# Altium schematic sheet 5_OUTPUTS.SchDoc
size 420 x 297 mm; SheetNumber: 5; SheetTotal: 5
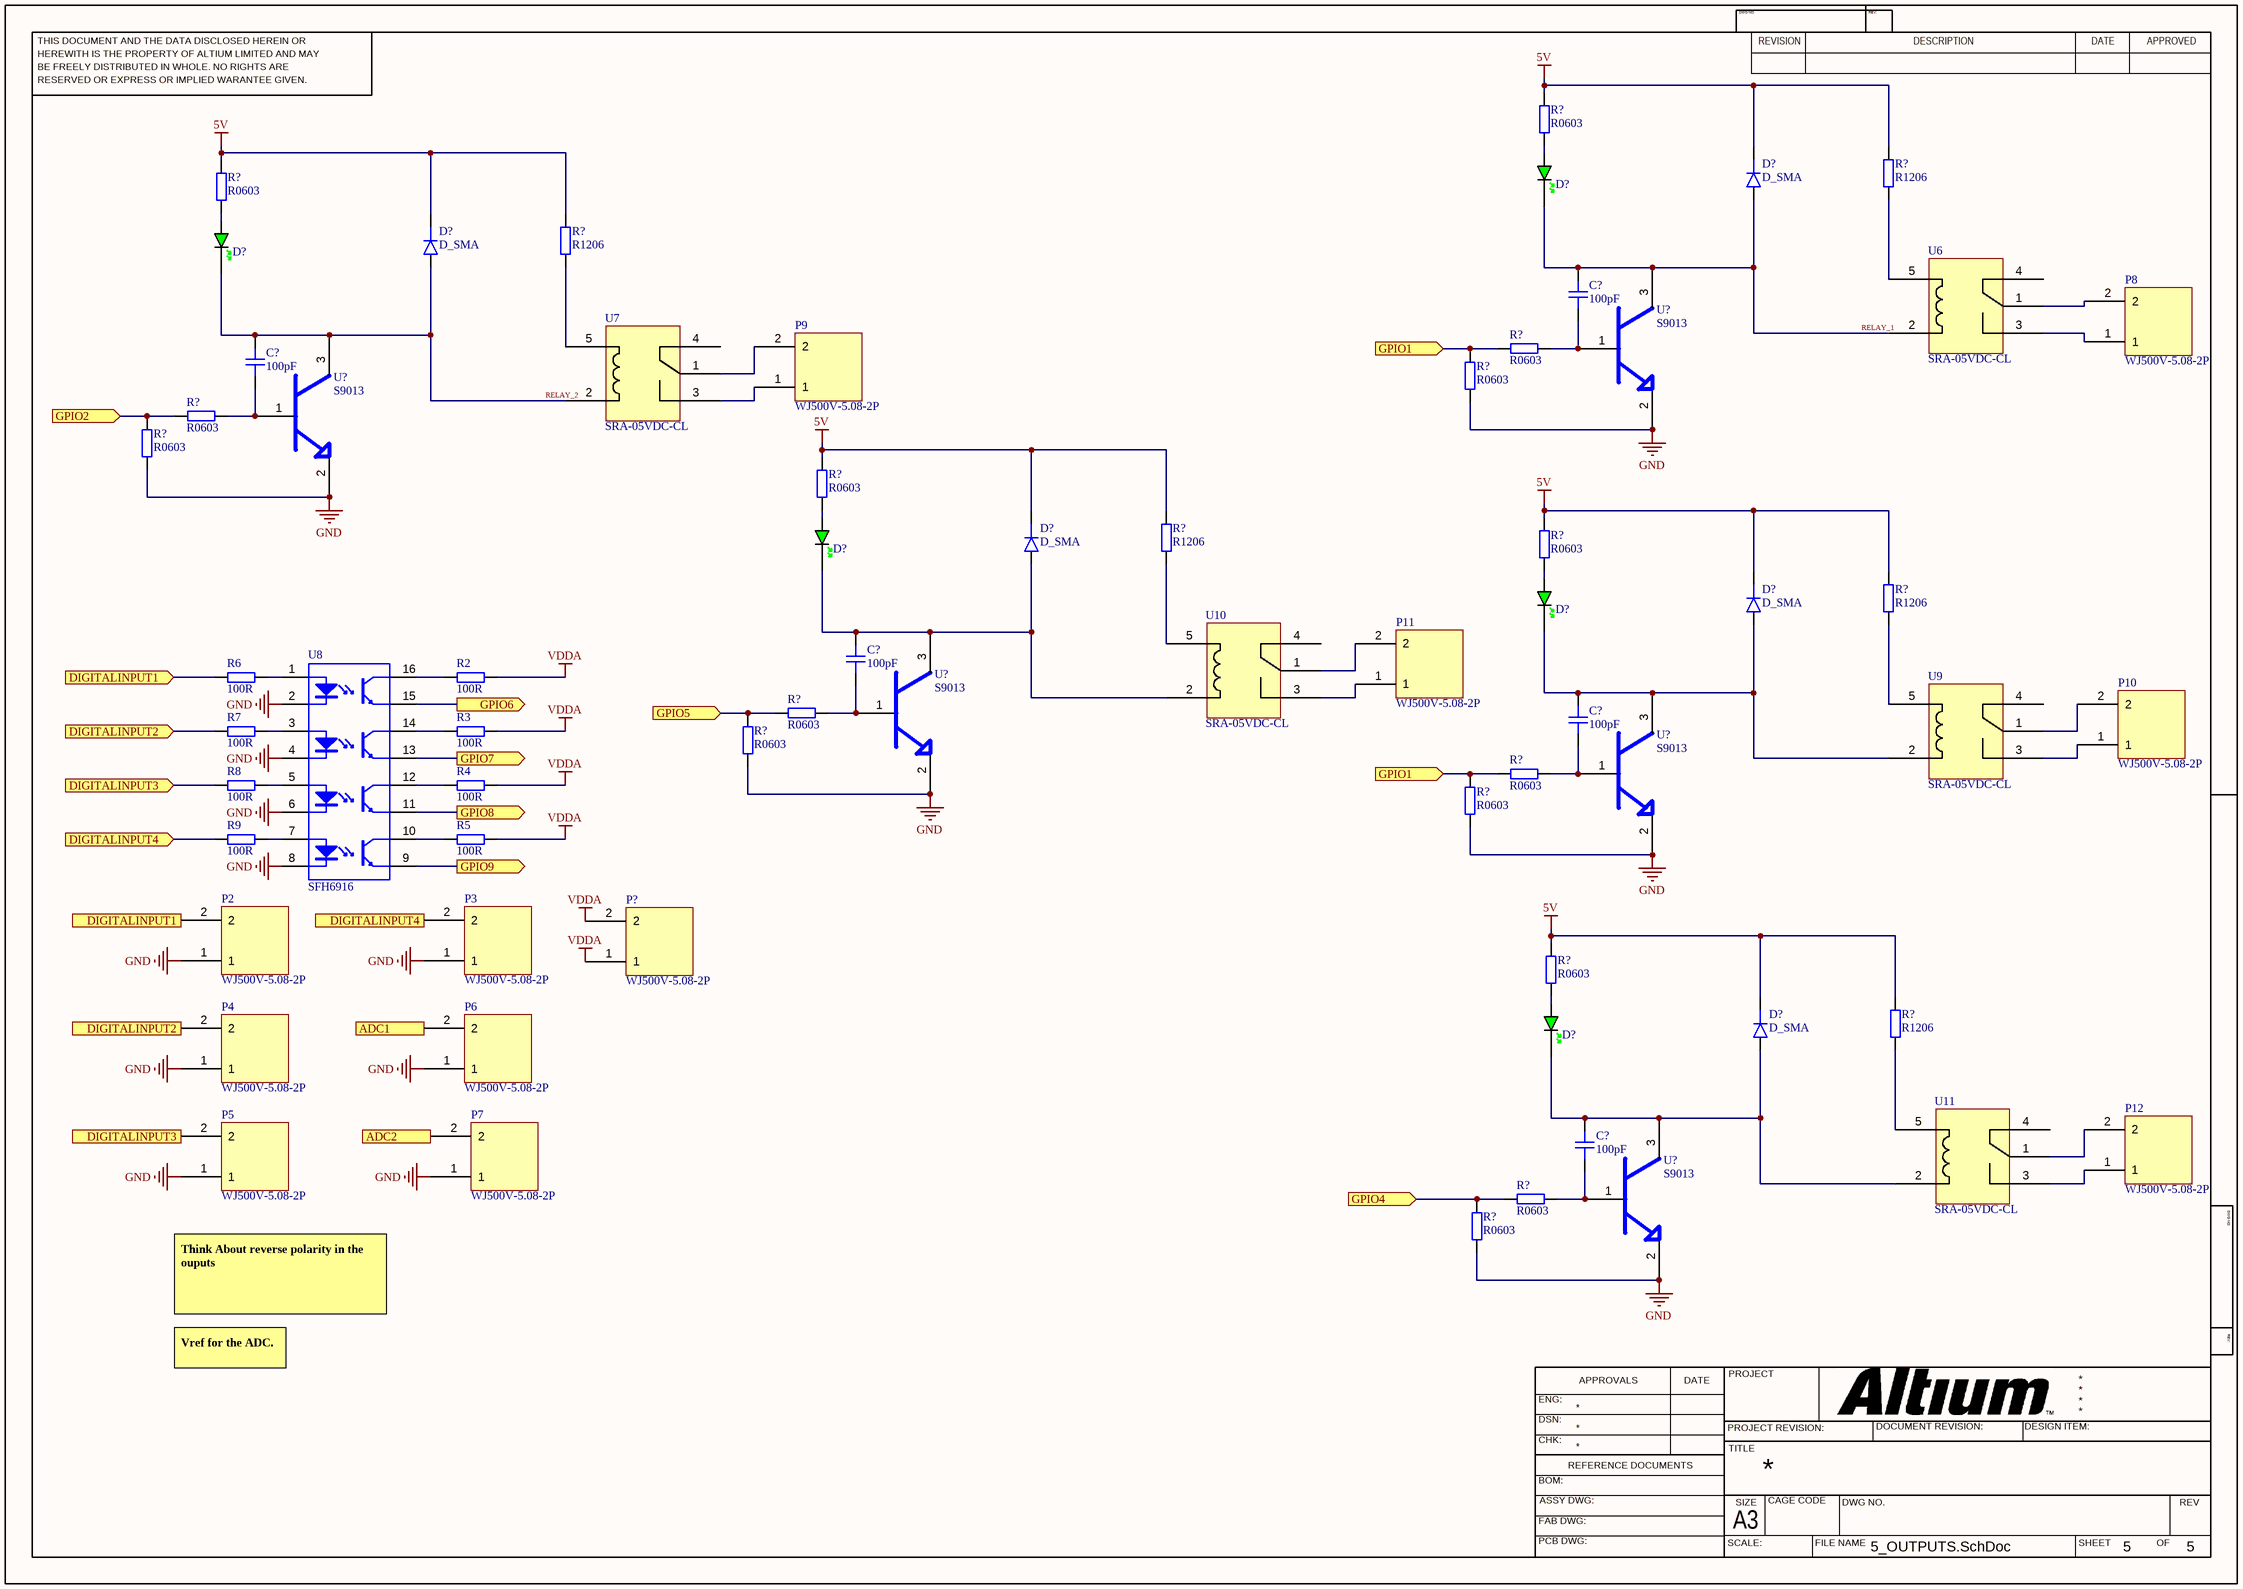
[diagram p0: 5_OUTPUTS.SchDoc]

## Parts
(Parts that share a designator on the sheet are numbered #1, #2 ... from top to bottom, then left to right.)
C?#1  100pF  [CAP_0603]
C?#2  100pF  [CAP_0603]
C?#3  100pF  [CAP_0603]
C?#4  100pF  [CAP_0603]
C?#5  100pF  [CAP_0603]
D?#1  D_SMA  [DO-214AC-2 (SMA)]
D?#2  GREEN  [LED_0603_GREEN]  (value not drawn)
D?#3  D_SMA  [DO-214AC-2 (SMA)]
D?#4  GREEN  [LED_0603_GREEN]  (value not drawn)
D?#5  D_SMA  [DO-214AC-2 (SMA)]
D?#6  GREEN  [LED_0603_GREEN]  (value not drawn)
D?#7  D_SMA  [DO-214AC-2 (SMA)]
D?#8  GREEN  [LED_0603_GREEN]  (value not drawn)
D?#9  D_SMA  [DO-214AC-2 (SMA)]
D?#10  GREEN  [LED_0603_GREEN]  (value not drawn)
P2  WJ500V-5.08-2P  [WJ500V-5.08-2P]
P3  WJ500V-5.08-2P  [WJ500V-5.08-2P]
P4  WJ500V-5.08-2P  [WJ500V-5.08-2P]
P5  WJ500V-5.08-2P  [WJ500V-5.08-2P]
P6  WJ500V-5.08-2P  [WJ500V-5.08-2P]
P7  WJ500V-5.08-2P  [WJ500V-5.08-2P]
P8  WJ500V-5.08-2P  [WJ500V-5.08-2P]
P9  WJ500V-5.08-2P  [WJ500V-5.08-2P]
P10  WJ500V-5.08-2P  [WJ500V-5.08-2P]
P11  WJ500V-5.08-2P  [WJ500V-5.08-2P]
P12  WJ500V-5.08-2P  [WJ500V-5.08-2P]
P?  WJ500V-5.08-2P  [WJ500V-5.08-2P]
R2  100R  [RES_0603]
R3  100R  [RES_0603]
R4  100R  [RES_0603]
R5  100R  [RES_0603]
R6  100R  [RES_0603]
R7  100R  [RES_0603]
R8  100R  [RES_0603]
R9  100R  [RES_0603]
R?#1  R0603  [RES_0603]
R?#2  R1206  [RES_1206]
R?#3  R0603  [RES_0603]
R?#4  R1206  [RES_1206]
R?#5  R0603  [RES_0603]
R?#6  R0603  [RES_0603]
R?#7  R0603  [RES_0603]
R?#8  R0603  [RES_0603]
R?#9  R0603  [RES_0603]
R?#10  R1206  [RES_1206]
R?#11  R0603  [RES_0603]
R?#12  R1206  [RES_1206]
R?#13  R0603  [RES_0603]
R?#14  R0603  [RES_0603]
R?#15  R0603  [RES_0603]
R?#16  R0603  [RES_0603]
R?#17  R0603  [RES_0603]
R?#18  R1206  [RES_1206]
R?#19  R0603  [RES_0603]
R?#20  R0603  [RES_0603]
U6  SRA-05VDC-CL  [SRA-05VDC-CL]
U7  SRA-05VDC-CL  [SRA-05VDC-CL]
U8  SFH6916  [VISH-SOP-16_V]
U9  SRA-05VDC-CL  [SRA-05VDC-CL]
U10  SRA-05VDC-CL  [SRA-05VDC-CL]
U11  SRA-05VDC-CL  [SRA-05VDC-CL]
U?#1  S9013  [SOT-23-3]
U?#2  S9013  [SOT-23-3]
U?#3  S9013  [SOT-23-3]
U?#4  S9013  [SOT-23-3]
U?#5  S9013  [SOT-23-3]

## Ports
ADC1 (in, see 1_BLOCK[2D], 3_MCU[3A]), ADC2 (in, see 1_BLOCK[2D], 3_MCU[2A]), DIGITALINPUT1 (in, see 1_BLOCK[2C]), DIGITALINPUT1 (out, see 1_BLOCK[2C]), DIGITALINPUT2 (in, see 1_BLOCK[2C]), DIGITALINPUT2 (out, see 1_BLOCK[2C]), DIGITALINPUT3 (in, see 1_BLOCK[2C]), DIGITALINPUT3 (out, see 1_BLOCK[2C]), DIGITALINPUT4 (in, see 1_BLOCK[2D]), DIGITALINPUT4 (out, see 1_BLOCK[2D]), GPIO1 (in, see 1_BLOCK[2C], 3_MCU[4B]), GPIO2 (in, see 1_BLOCK[2C], 3_MCU[5B]), GPIO4 (in, see 1_BLOCK[2C], 3_MCU[4C]), GPIO5 (in, see 1_BLOCK[2C], 3_MCU[5C]), GPIO6 (out, see 1_BLOCK[2D], 3_MCU[4B]), GPIO7 (out, see 1_BLOCK[2D], 3_MCU[5B]), GPIO8 (out, see 1_BLOCK[2D], 3_MCU[2B]), GPIO9 (out, see 1_BLOCK[2D], 3_MCU[3B])

## Nets
5V: D?#1.K D?#3.K D?#5.K D?#7.K D?#9.K R?#1.2 R?#2.2 R?#3.2 R?#4.2 R?#9.2 R?#10.2 R?#11.2 R?#12.2 R?#17.2 R?#18.2
GND: P2.1 P3.1 P4.1 P5.1 P6.1 P7.1 R?#6.1 R?#8.1 R?#14.1 R?#16.1 R?#20.1 U8.2(C) U8.4(C) U8.6(C) U8.8(C) U?#1.2 U?#2.2 U?#3.2 U?#4.2 U?#5.2
VDDA: P?.1 P?.2 R2.2 R3.2 R4.2 R5.2
ADC1: P6.2 ; port ADC1
ADC2: P7.2 ; port ADC2
DIGITALINPUT1: P2.2 R6.1 ; port DIGITALINPUT1
DIGITALINPUT2: P4.2 R7.1 ; port DIGITALINPUT2
DIGITALINPUT3: P5.2 R8.1 ; port DIGITALINPUT3
DIGITALINPUT4: P3.2 R9.1 ; port DIGITALINPUT4
GPIO1: R?#5.1 R?#6.2 R?#15.1 R?#16.2 ; port GPIO1
GPIO2: R?#7.1 R?#8.2 ; port GPIO2
GPIO4: R?#19.1 R?#20.2 ; port GPIO4
GPIO5: R?#13.1 R?#14.2 ; port GPIO5
GPIO6: U8.15(E) ; port GPIO6
GPIO7: U8.13(E) ; port GPIO7
GPIO8: U8.11(E) ; port GPIO8
GPIO9: U8.9(E) ; port GPIO9
RELAY_1: C?#1.1 D?#1.A D?#2.K U6.2 U?#1.3
RELAY_2: C?#2.1 D?#3.A D?#4.K U7.2 U?#2.3
NetC?#1_2: C?#1.2 R?#5.2 U?#1.1
NetC?#2_2: C?#2.2 R?#7.2 U?#2.1
NetC?#3_1: C?#3.1 D?#5.A D?#6.K U10.2 U?#3.3
NetC?#3_2: C?#3.2 R?#13.2 U?#3.1
NetC?#4_1: C?#4.1 D?#7.A D?#8.K U9.2 U?#4.3
NetC?#4_2: C?#4.2 R?#15.2 U?#4.1
NetC?#5_1: C?#5.1 D?#9.A D?#10.K U11.2 U?#5.3
NetC?#5_2: C?#5.2 R?#19.2 U?#5.1
NetD?#2_A: D?#2.A R?#1.1
NetD?#4_A: D?#4.A R?#3.1
NetD?#6_A: D?#6.A R?#9.1
NetD?#8_A: D?#8.A R?#11.1
NetD?#10_A: D?#10.A R?#17.1
NetP8_1: P8.1 U6.3
NetP8_2: P8.2 U6.1
NetP9_1: P9.1 U7.3
NetP9_2: P9.2 U7.1
NetP10_1: P10.1 U9.3
NetP10_2: P10.2 U9.1
NetP11_1: P11.1 U10.3
NetP11_2: P11.2 U10.1
NetP12_1: P12.1 U11.3
NetP12_2: P12.2 U11.1
NetR2_1: R2.1 U8.16(C)
NetR3_1: R3.1 U8.14(C)
NetR4_1: R4.1 U8.12(C)
NetR5_1: R5.1 U8.10(C)
NetR6_2: R6.2 U8.1(A)
NetR7_2: R7.2 U8.3(A)
NetR8_2: R8.2 U8.5(A)
NetR9_2: R9.2 U8.7(A)
NetR?#2_1: R?#2.1 U6.5
NetR?#4_1: R?#4.1 U7.5
NetR?#10_1: R?#10.1 U10.5
NetR?#12_1: R?#12.1 U9.5
NetR?#18_1: R?#18.1 U11.5

Not connected (* = marked no-connect by the designer): U6 4; U7 4; U9 4; U10 4; U11 4

## Notes on the sheet
- Think About reverse polarity in the ouputs
- Vref for the ADC.
- THIS DOCUMENT AND THE DATA DISCLOSED HEREIN OR
- HEREWITH IS THE PROPERTY OF ALTIUM LIMITED AND MAY
- DWG NO:
- REVISION
- REV:
- DESCRIPTION
- DATE
- APPROVED
- BE FREELY DISTRIBUTED IN WHOLE. NO RIGHTS ARE
- RESERVED OR EXPRESS OR IMPLIED WARANTEE GIVEN.
- ENG:
- APPROVALS
- PROJECT
- DSN:
- CHK:
- REFERENCE DOCUMENTS
- PROJECT REVISION:
- TITLE
- DOCUMENT REVISION:
- DESIGN ITEM:
- BOM:
- FAB DWG:
- PCB DWG:
- ASSY DWG:
- SCALE:
- A3
- SIZE
- CAGE CODE
- FILE NAME
- DWG NO.
- SHEET
- OF
- REV

## Library data of the parts
C?#1-C?#5 = CAP_0603_16V: Capacitor SMD 0603 16V
D?#1 D?#3 D?#5 D?#7 D?#9 = D_SMA: Diode SMD SMA (DO-214AA)
D?#2 D?#4 D?#6 D?#8 D?#10 = LED_0603_GREEN: LED 0603 GREEN SMD
P2-P12 P? = WJ500V-5.08-2P: 1x2P 18A -40℃~+105℃ 250V Green 14~30 Straight 5.08mm 2.5 1 2 Plugin,P=5.08mm Screw terminal ROHS
R2-R9 R?#1 R?#3 R?#5-R?#9 R?#11 R?#13-R?#17 R?#19 R?#20 = RES_0603: Resistor SMD 0603; Manufacturer: *; Manufacturer Part Number: *; Distributor Link: *
R?#2 R?#4 R?#10 R?#12 R?#18 = RES_1206: Resistor SMD 1206; Manufacturer: *; Manufacturer Part Number: *; Distributor Link: *
U6 U7 U9-U11 = SRA-05VDC-CL: 5V 10A 20A@14VAC SPDT (1 Form C) 5 Plugin,12.4x16mm Power Relays ROHS
U8 = CMP-2000-07047-1: Optocoupler, Phototransistor Output, Quad Channel, 50 mA, 1.15 V, -55 to 100 degC, 16-Pin SOP, Pb-Free, Tube; Manufacturer: Vishay; Collector Current (DC): 0.1A; Rad Hardened: No; Input Type: DC; Power Dissipation: 0.15W; Current Transfer Ratio: 300%; Reverse Breakdown Voltage: 6V; Collector-Emitter Voltage: 70V; DELETED: Compliant; Forward Current: 50mA; Number of  Elements: 4; Forward Voltage: 1.4V; Collector-Emitter Saturation Voltage: 0.4V; Isolation Voltage: 3750V; Package Reference: SOP-16; Operating Temperature Classification: Industrial; Manufacturer URL: http://www.vishay.com/; Mounting Technology: SurfaceMount; Operating Temp Range: -55Cto100C; Package Type: SOP; Collector Current (DC) (Max): 0.1A; Output Type: DC; Datasheet URL: https://datasheet.ciiva.com/26913/sfh6916-26913222.pdf; Output Device: Transistor; Datasheet Version: Rev. 2.0, 12/2011; Package Description: 16-Pin Small Outline Package Integrated Circuit, Body 4.575 x 10.77 mm, Pitch 1.27 mm; Mounting: SurfaceMount; Pin Count: 16
U?#1-U?#5 = S9013: SOT-23 Bipolar Transistors - BJT ROHS